# EAGLE schematic 226_arrayrelay (EAGLE 9.6.0)

## Sheet 1 of 9
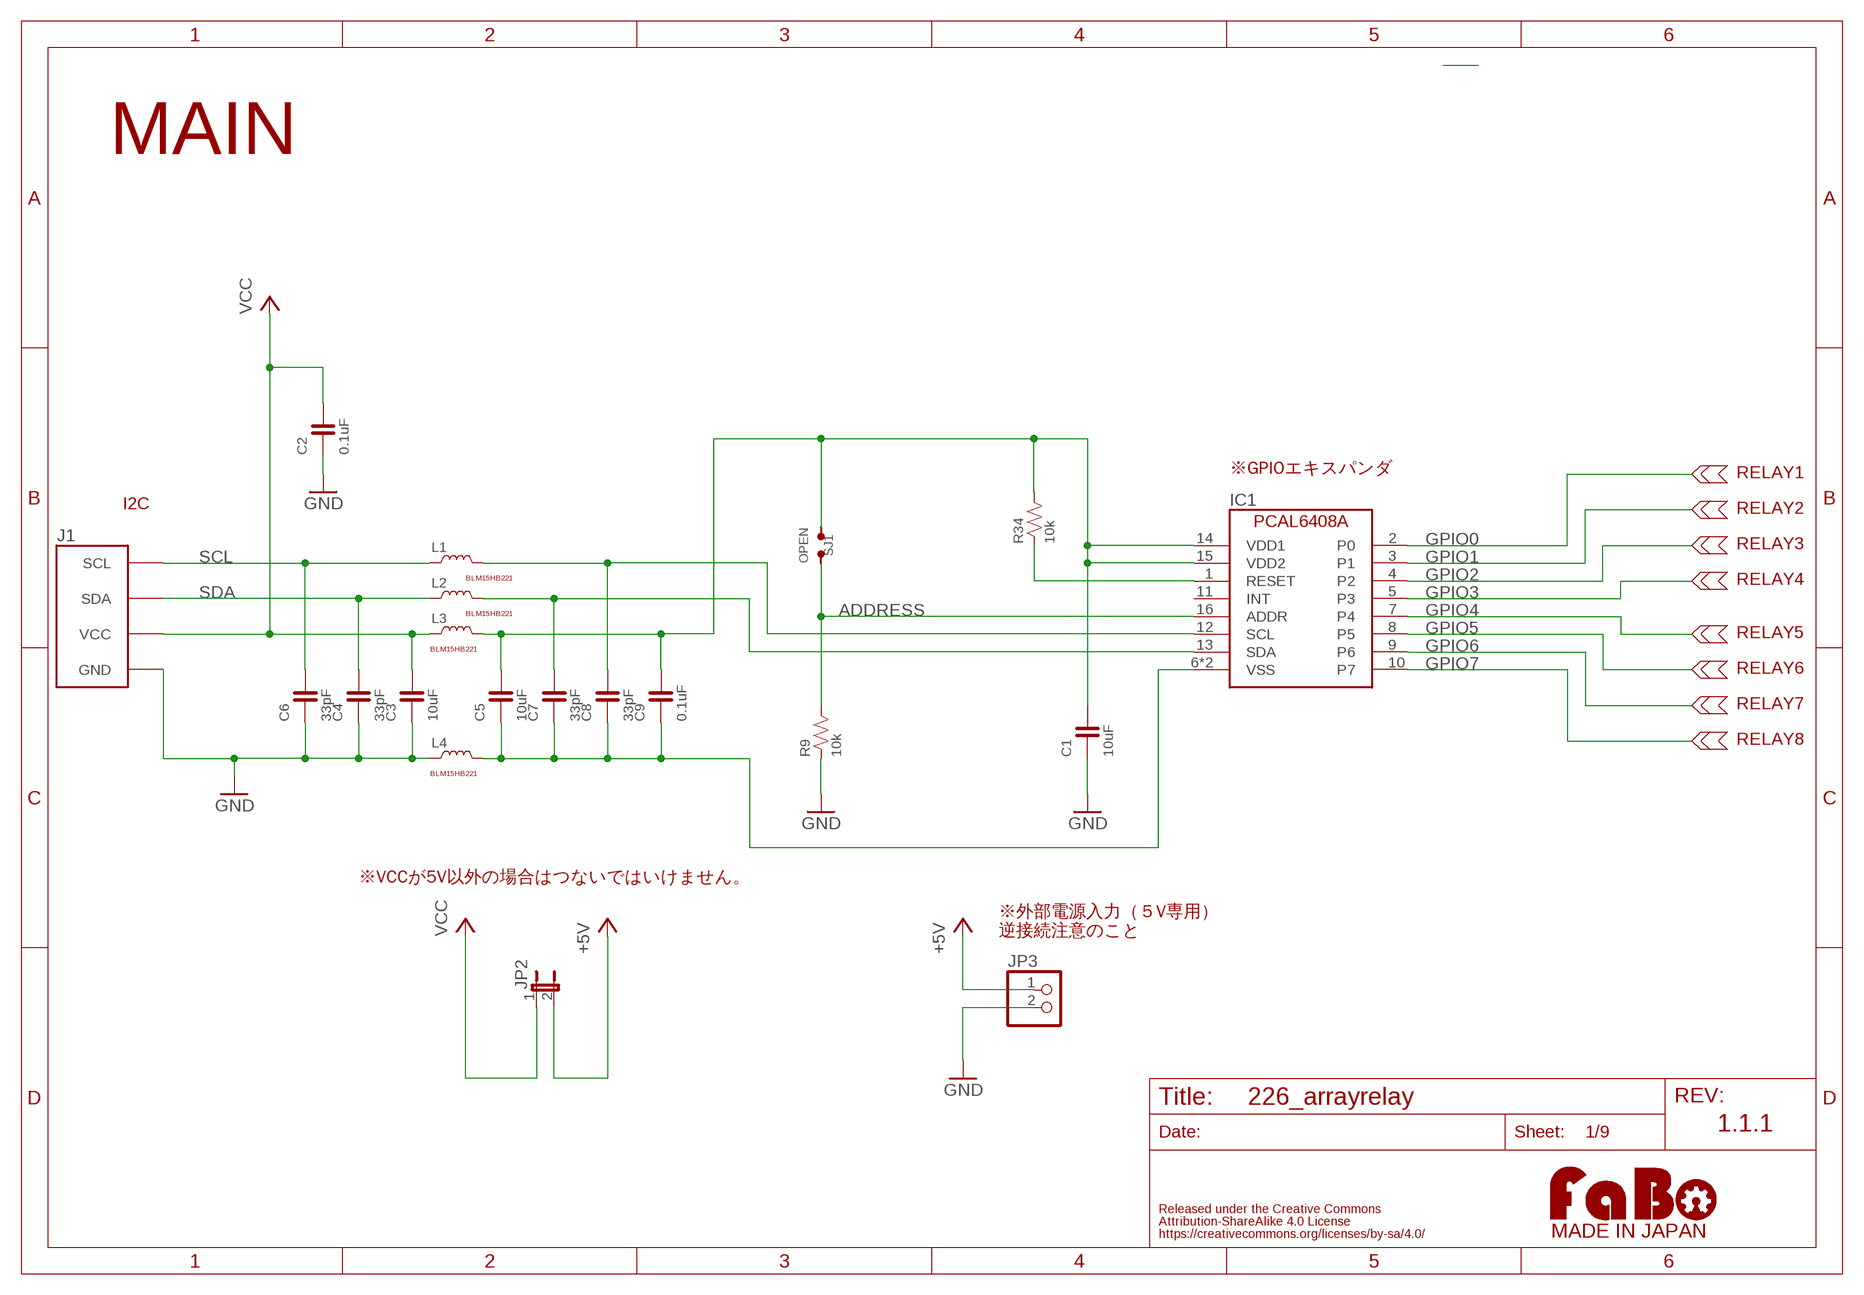
[diagram p0: schematic, sheet 1]

### Parts
C1  10uF  CAPACITOR-0603  [0603]
C2  0.1uF  CAPACITOR-0603  [0603]
C3  10uF  CAPACITOR-0603  [0603]
C4  33pF  CAPACITOR-0603  [0603]
C5  10uF  CAPACITOR-0603  [0603]
C6  33pF  CAPACITOR-0603  [0603]
C7  33pF  CAPACITOR-0603  [0603]
C8  33pF  CAPACITOR-0603  [0603]
C9  0.1uF  CAPACITOR-0603  [0603]
IC1  NX-PCAL6408A  [NXP-PCAL6408A]
J1  FABO_BRICK_I2C-S04B-PASK-2_LONG  [FABO_BRICK_I2C_S04B-PASK-2_LONG]
JP2  JP1E  [JP1]
JP3  PINHD-1X2  [1X02]
L1  COIL-0402  [0402]
L2  COIL-0402  [0402]
L3  COIL-0402  [0402]
L4  COIL-0402  [0402]
R9  10k  RESISTOR-0603-NARROW  [0603-NARROW]
R34  10k  RESISTOR-0603-NARROW  [0603-NARROW]
SJ1  OPEN  SMD-JUMPER-2-OPEN  [SMD-JUMPER-2-OPEN]
U$4  LOGO_FABO-M  [LOGO_FABO_MS]

### Nets
+5V: JP2.2 JP3.1 ; also sheet 2,3,4,5,6,7,8,9
ADDRESS: IC1.16(ADDR) R9.2 SJ1.2
GND: C1.1 C2.1 C3.1 C4.1 C6.1 J1.GND JP3.2 L4.P$1 R9.1 ; also sheet 2,3,4,5,6,7,8,9
GPIO0: IC1.2(P0) ; also sheet 2
GPIO1: IC1.3(P1) ; also sheet 3
GPIO2: IC1.4(P2) ; also sheet 4
GPIO3: IC1.5(P3) ; also sheet 5
GPIO4: IC1.7(P4) ; also sheet 6
GPIO5: IC1.8(P5) ; also sheet 7
GPIO6: IC1.9(P6) ; also sheet 8
GPIO7: IC1.10(P7) ; also sheet 9
N$66: IC1.1(RESET) R34.1
N$70: C8.2 IC1.12(SCL) L1.P$2
N$71: C7.2 IC1.13(SDA) L2.P$2
N$72: C1.2 C5.2 C9.2 IC1.14(VDD1) IC1.15(VDD2) L3.P$2 R34.2 SJ1.1
N$73: C5.1 C7.1 C8.1 C9.1 IC1.6(VSS) IC1.17(VSS) L4.P$2
SCL: C6.2 J1.SCL L1.P$1
SDA: C4.2 J1.SDA L2.P$1
VCC: C2.2 C3.2 J1.VCC JP2.1 L3.P$1 ; also sheet 2,3,4,5,6,7,8,9
Unconnected: IC1.11(INT)

### Notes on the sheet
- MAIN
- ※GPIOエキスパンダ | RELAY1
- ※I2C | RELAY2
- RELAY3
- BLM15HB221
- RELAY4
- BLM15HB221
- RELAY5
- BLM15HB221
- RELAY6
- RELAY7
- RELAY8
- BLM15HB221
- ※VCCが5V以外の場合はつないではいけません。
- ※外部電源入力（５V専用）
  逆接続注意のこと
- 1.1.1

## Sheet 2 of 9
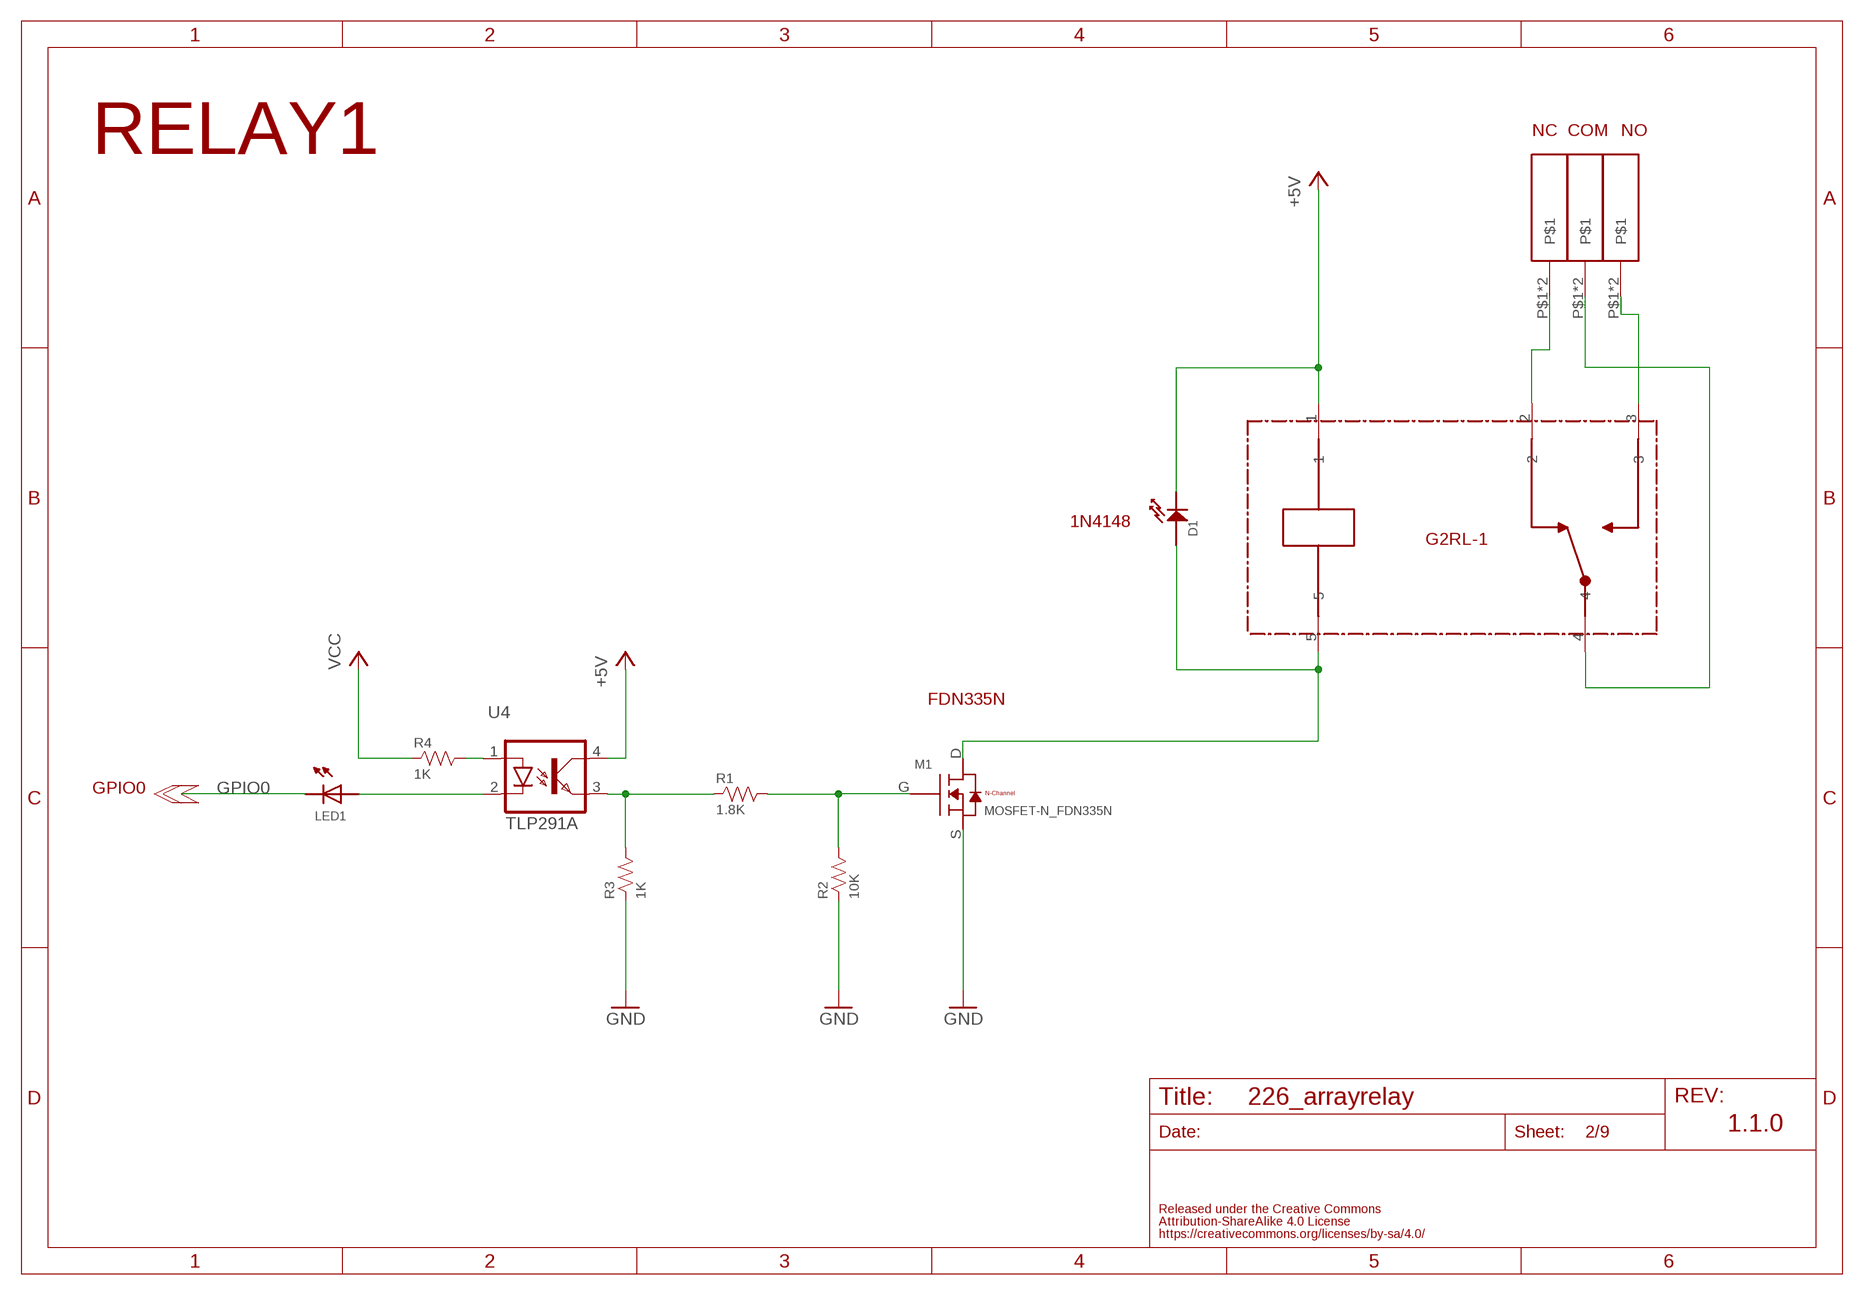
[diagram p1: schematic, sheet 2]

### Parts
COM1  TBL004-508  [TBL004-508]
D1  1N4188  DIODE0603  [0603]
LED1  LED-0402-NO_SILK  [0402-NO_SILK]
M1  MOSFET-N_FDN335N  [SUPERSOT-3]
NC1  TBL004-508  [TBL004-508]
R1  1.8K  RESISTOR-0603-NARROW  [0603-NARROW]
R2  10K  RESISTOR-0603-NARROW  [0603-NARROW]
R3  1K  RESISTOR-0603-NARROW  [0603-NARROW]
R4  1K  RESISTOR-0603-NARROW  [0603-NARROW]
RL1  G2RL-1  [G2RL-1]
U4  TLP291A  [11-3C1]
U$7  TBL004-508  [TBL004-508]

### Nets
+5V: D1.CATHODE RL1.1 U4.4(COL) ; also sheet 1,3,4,5,6,7,8,9
GND: M1.S R2.1 R3.1 ; also sheet 1,3,4,5,6,7,8,9
GPIO0: LED1.CATHODE ; also sheet 1
N$2: D1.ANODE M1.D RL1.5
N$3: R1.1 R3.2 U4.3(EMI)
N$4: M1.G R1.2 R2.2
N$5: LED1.ANODE U4.2(C)
N$7: R4.2 U4.1(A)
N$8: NC1.P$1 NC1.P$2 RL1.2
N$9: COM1.P$1 COM1.P$2 RL1.4
N$10: RL1.3 U$7.P$1 U$7.P$2
VCC: R4.1 ; also sheet 1,3,4,5,6,7,8,9

### Notes on the sheet
- NC | COM | NO
- RELAY1
- 1N4148
- G2RL-1
- FDN335N
- GPIO0
- 1.1.0

## Sheet 3 of 9
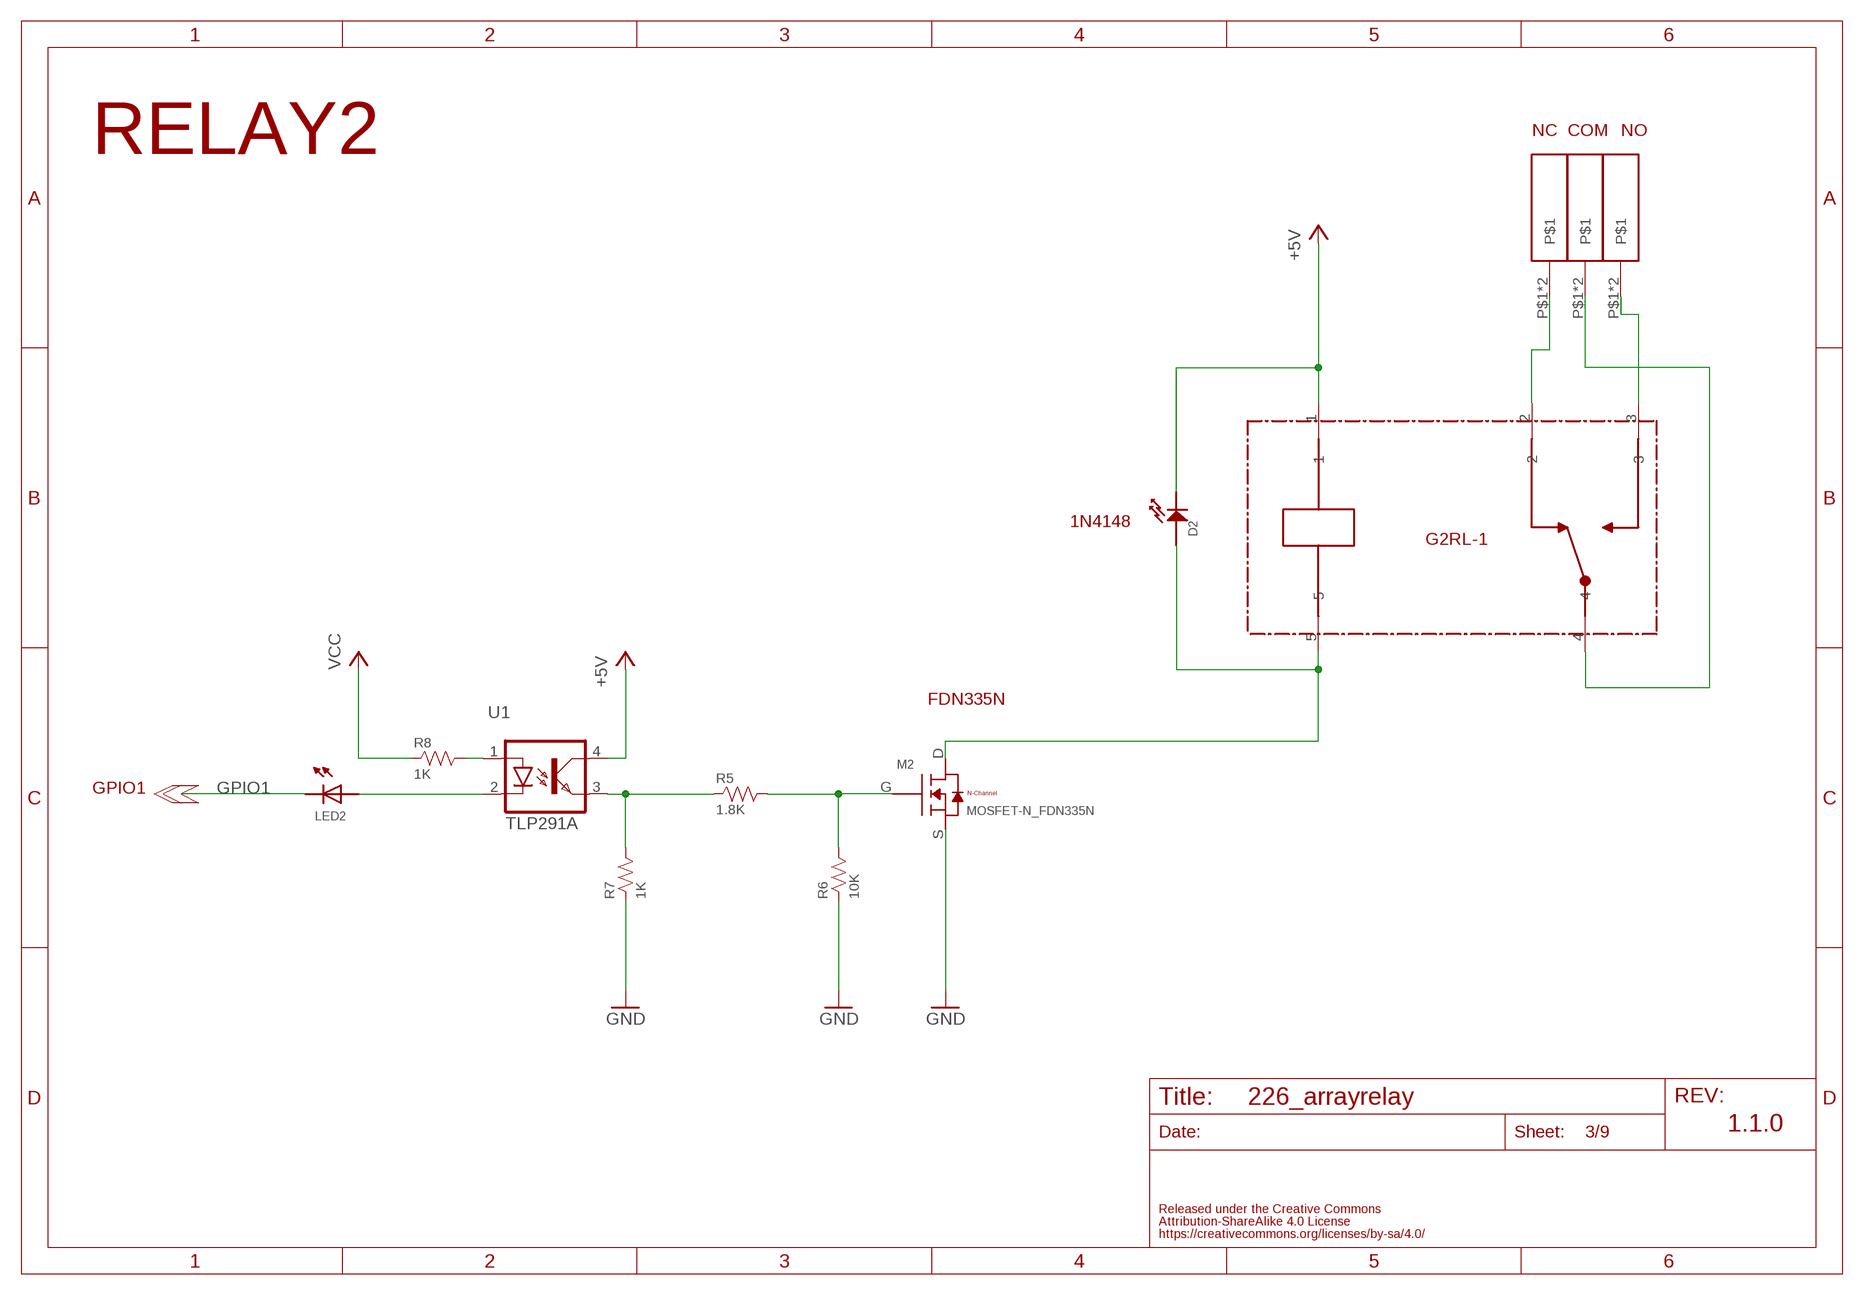
[diagram p2: schematic, sheet 3]

### Parts
COM2  TBL004-508  [TBL004-508]
D2  1N4188  DIODE0603  [0603]
LED2  LED-0402-NO_SILK  [0402-NO_SILK]
M2  MOSFET-N_FDN335N  [SUPERSOT-3]
NC2  TBL004-508  [TBL004-508]
R5  1.8K  RESISTOR-0603-NARROW  [0603-NARROW]
R6  10K  RESISTOR-0603-NARROW  [0603-NARROW]
R7  1K  RESISTOR-0603-NARROW  [0603-NARROW]
R8  1K  RESISTOR-0603-NARROW  [0603-NARROW]
RL2  G2RL-1  [G2RL-1]
U1  TLP291A  [11-3C1]
U$9  TBL004-508  [TBL004-508]

### Nets
+5V: D2.CATHODE RL2.1 U1.4(COL) ; also sheet 1,2,4,5,6,7,8,9
GND: M2.S R6.1 R7.1 ; also sheet 1,2,4,5,6,7,8,9
GPIO1: LED2.CATHODE ; also sheet 1
N$6: D2.ANODE M2.D RL2.5
N$11: R5.1 R7.2 U1.3(EMI)
N$12: M2.G R5.2 R6.2
N$13: NC2.P$1 NC2.P$2 RL2.2
N$14: COM2.P$1 COM2.P$2 RL2.4
N$15: RL2.3 U$9.P$1 U$9.P$2
N$16: LED2.ANODE U1.2(C)
N$17: R8.2 U1.1(A)
VCC: R8.1 ; also sheet 1,2,4,5,6,7,8,9

### Notes on the sheet
- NC | COM | NO
- RELAY2
- 1N4148
- G2RL-1
- FDN335N
- GPIO1
- 1.1.0

## Sheet 4 of 9
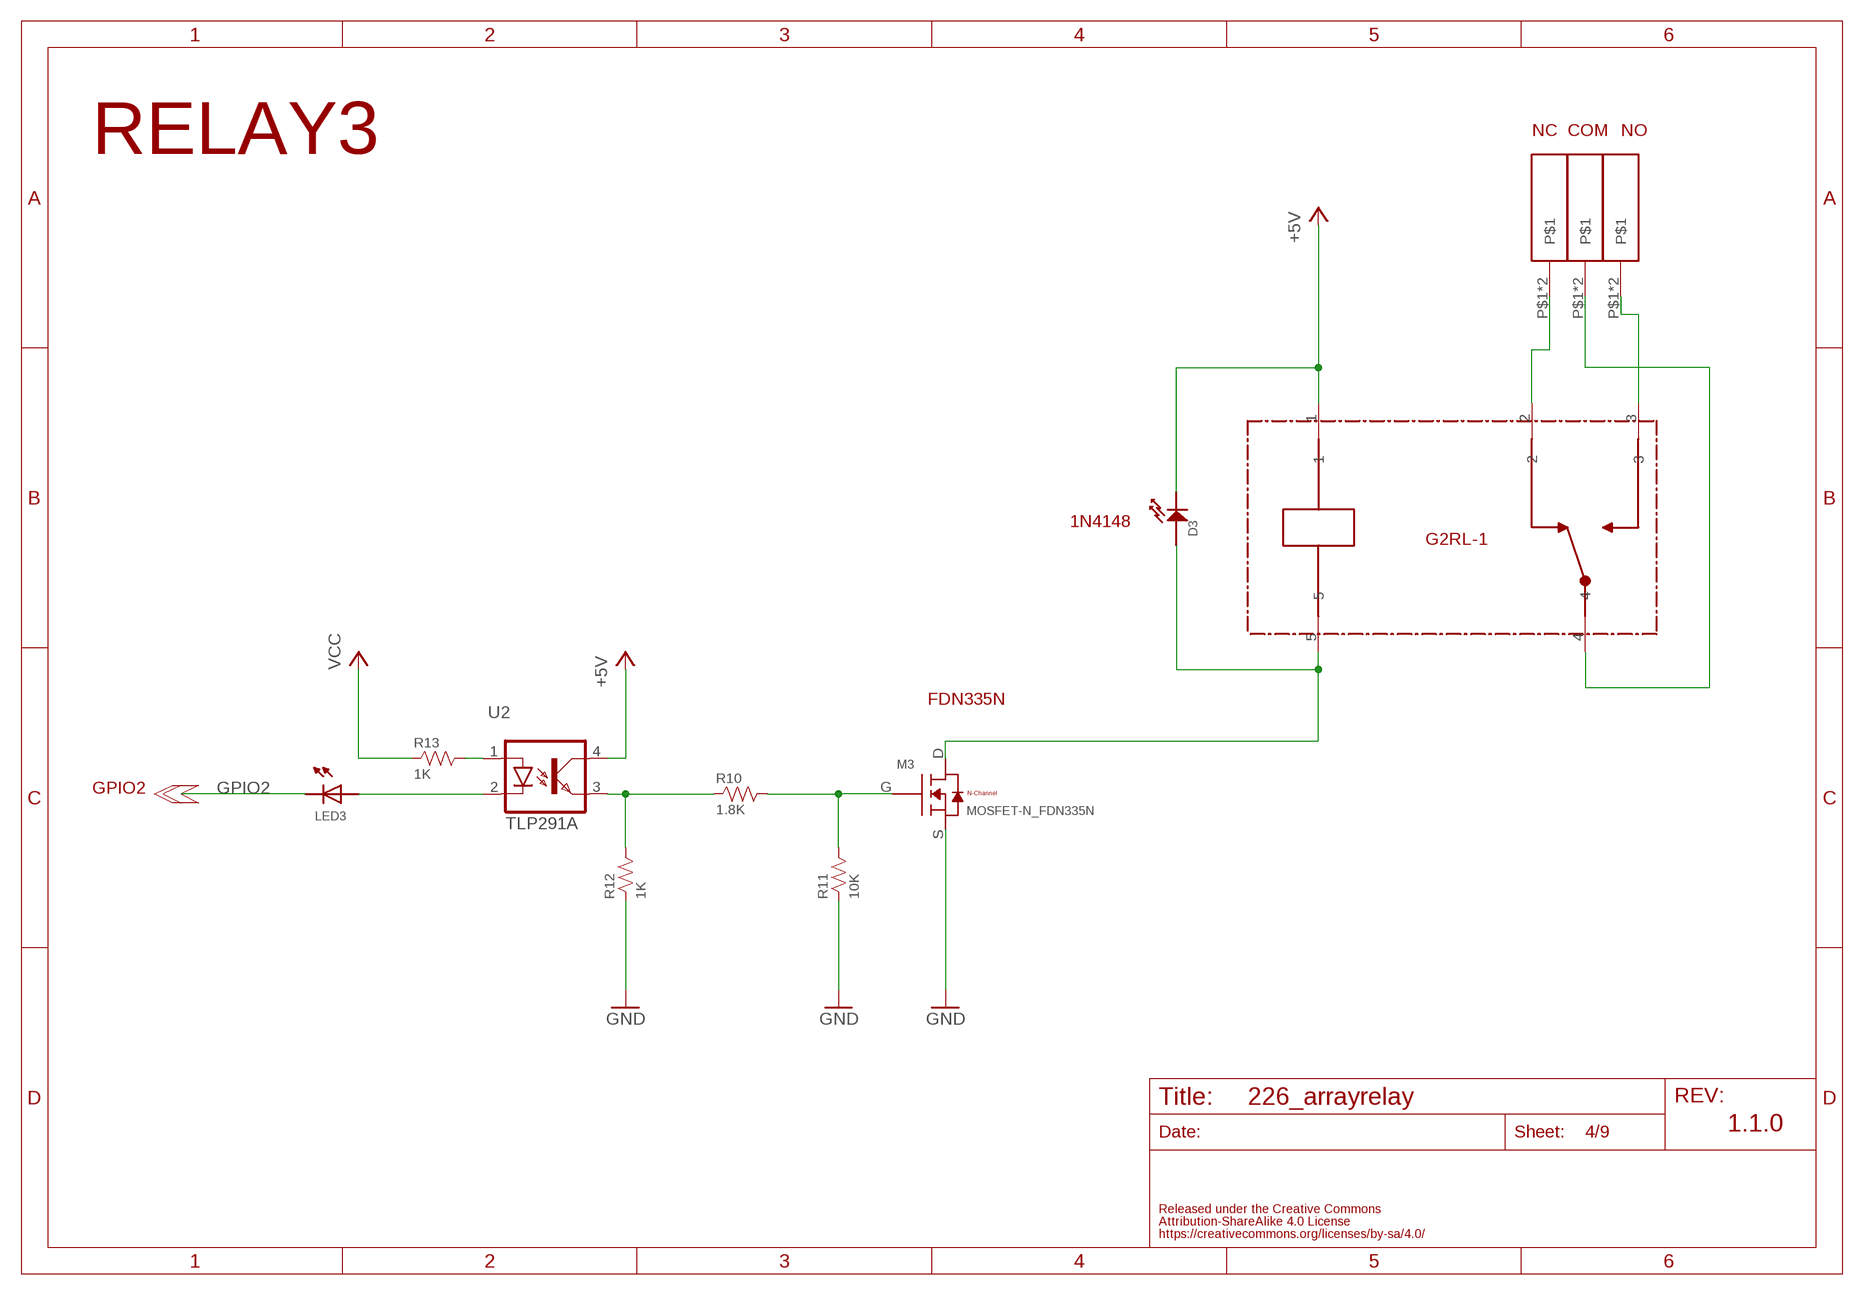
[diagram p3: schematic, sheet 4]

### Parts
COM3  TBL004-508  [TBL004-508]
D3  1N4188  DIODE0603  [0603]
LED3  LED-0402-NO_SILK  [0402-NO_SILK]
M3  MOSFET-N_FDN335N  [SUPERSOT-3]
NC3  TBL004-508  [TBL004-508]
R10  1.8K  RESISTOR-0603-NARROW  [0603-NARROW]
R11  10K  RESISTOR-0603-NARROW  [0603-NARROW]
R12  1K  RESISTOR-0603-NARROW  [0603-NARROW]
R13  1K  RESISTOR-0603-NARROW  [0603-NARROW]
RL3  G2RL-1  [G2RL-1]
U2  TLP291A  [11-3C1]
U$12  TBL004-508  [TBL004-508]

### Nets
+5V: D3.CATHODE RL3.1 U2.4(COL) ; also sheet 1,2,3,5,6,7,8,9
GND: M3.S R11.1 R12.1 ; also sheet 1,2,3,5,6,7,8,9
GPIO2: LED3.CATHODE ; also sheet 1
N$18: D3.ANODE M3.D RL3.5
N$19: R10.1 R12.2 U2.3(EMI)
N$20: M3.G R10.2 R11.2
N$21: NC3.P$1 NC3.P$2 RL3.2
N$22: COM3.P$1 COM3.P$2 RL3.4
N$23: RL3.3 U$12.P$1 U$12.P$2
N$24: LED3.ANODE U2.2(C)
N$25: R13.2 U2.1(A)
VCC: R13.1 ; also sheet 1,2,3,5,6,7,8,9

### Notes on the sheet
- NC | COM | NO
- RELAY3
- 1N4148
- G2RL-1
- FDN335N
- GPIO2
- 1.1.0

## Sheet 5 of 9
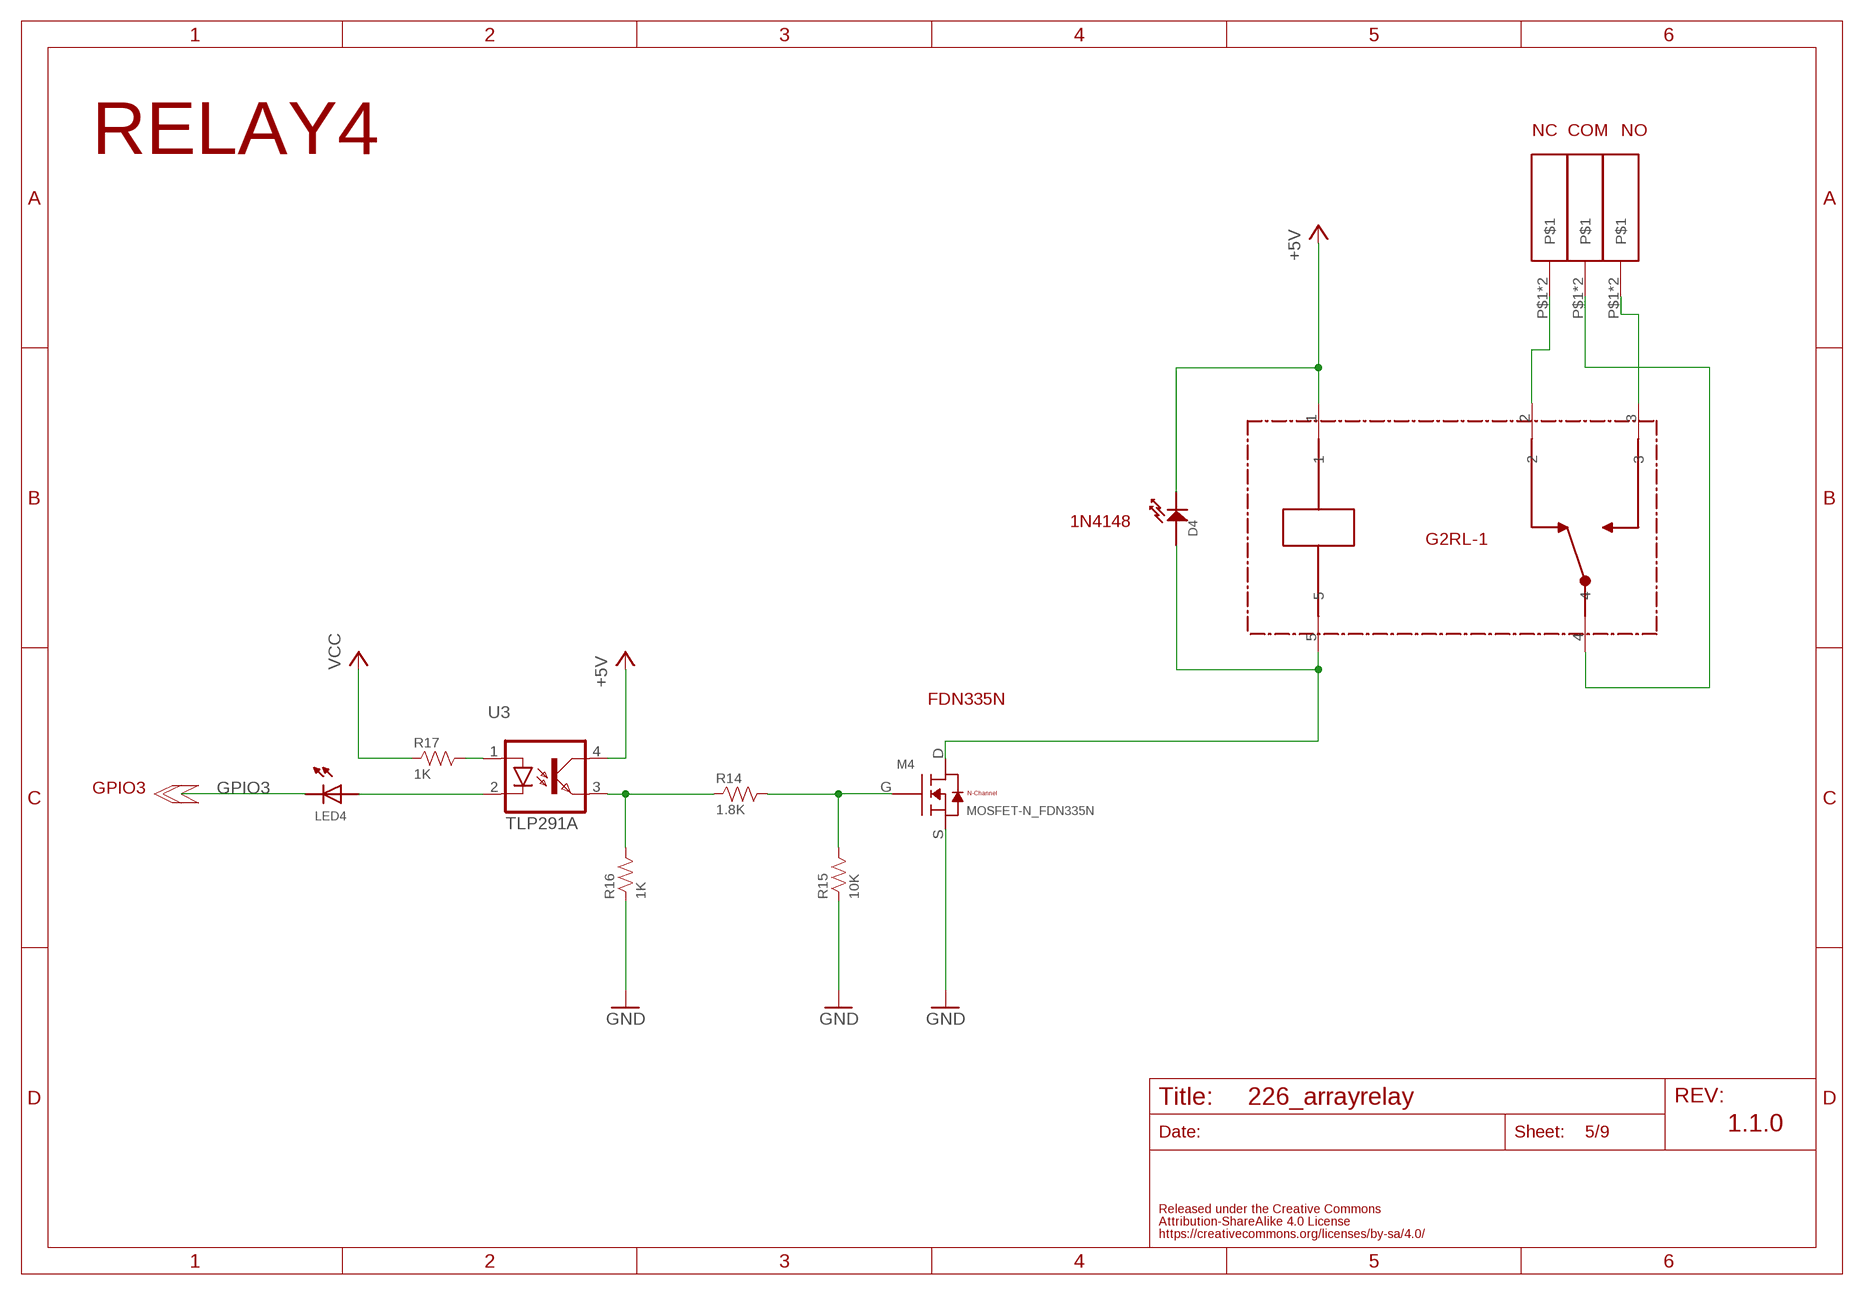
[diagram p4: schematic, sheet 5]

### Parts
COM4  TBL004-508  [TBL004-508]
D4  1N4188  DIODE0603  [0603]
LED4  LED-0402-NO_SILK  [0402-NO_SILK]
M4  MOSFET-N_FDN335N  [SUPERSOT-3]
NC4  TBL004-508  [TBL004-508]
R14  1.8K  RESISTOR-0603-NARROW  [0603-NARROW]
R15  10K  RESISTOR-0603-NARROW  [0603-NARROW]
R16  1K  RESISTOR-0603-NARROW  [0603-NARROW]
R17  1K  RESISTOR-0603-NARROW  [0603-NARROW]
RL4  G2RL-1  [G2RL-1]
U3  TLP291A  [11-3C1]
U$15  TBL004-508  [TBL004-508]

### Nets
+5V: D4.CATHODE RL4.1 U3.4(COL) ; also sheet 1,2,3,4,6,7,8,9
GND: M4.S R15.1 R16.1 ; also sheet 1,2,3,4,6,7,8,9
GPIO3: LED4.CATHODE ; also sheet 1
N$26: D4.ANODE M4.D RL4.5
N$27: R14.1 R16.2 U3.3(EMI)
N$28: M4.G R14.2 R15.2
N$29: NC4.P$1 NC4.P$2 RL4.2
N$30: COM4.P$1 COM4.P$2 RL4.4
N$31: RL4.3 U$15.P$1 U$15.P$2
N$32: LED4.ANODE U3.2(C)
N$33: R17.2 U3.1(A)
VCC: R17.1 ; also sheet 1,2,3,4,6,7,8,9

### Notes on the sheet
- NC | COM | NO
- RELAY4
- 1N4148
- G2RL-1
- FDN335N
- GPIO3
- 1.1.0

## Sheet 6 of 9
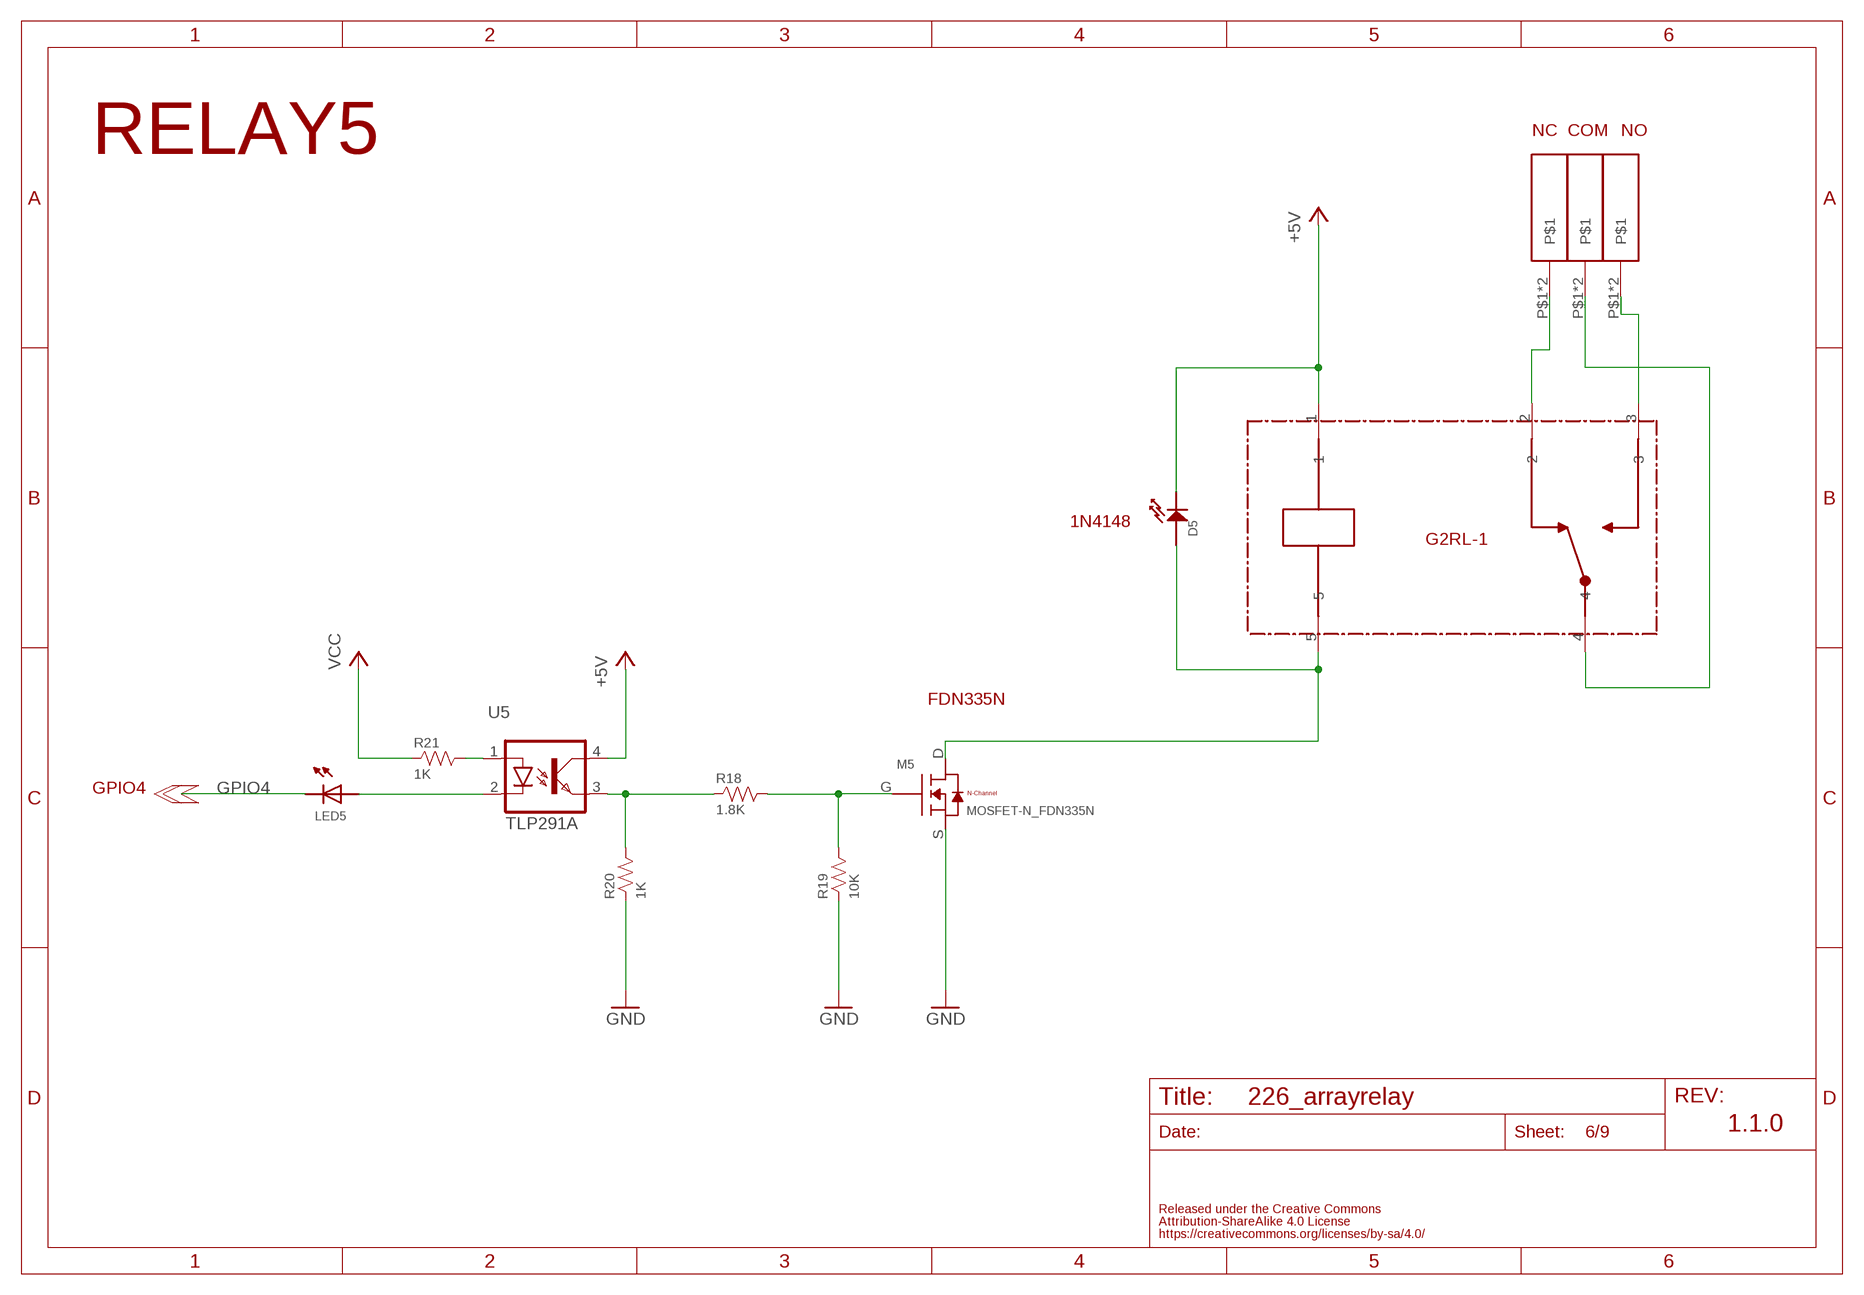
[diagram p5: schematic, sheet 6]

### Parts
COM5  TBL004-508  [TBL004-508]
D5  1N4188  DIODE0603  [0603]
LED5  LED-0402-NO_SILK  [0402-NO_SILK]
M5  MOSFET-N_FDN335N  [SUPERSOT-3]
NC5  TBL004-508  [TBL004-508]
R18  1.8K  RESISTOR-0603-NARROW  [0603-NARROW]
R19  10K  RESISTOR-0603-NARROW  [0603-NARROW]
R20  1K  RESISTOR-0603-NARROW  [0603-NARROW]
R21  1K  RESISTOR-0603-NARROW  [0603-NARROW]
RL5  G2RL-1  [G2RL-1]
U5  TLP291A  [11-3C1]
U$18  TBL004-508  [TBL004-508]

### Nets
+5V: D5.CATHODE RL5.1 U5.4(COL) ; also sheet 1,2,3,4,5,7,8,9
GND: M5.S R19.1 R20.1 ; also sheet 1,2,3,4,5,7,8,9
GPIO4: LED5.CATHODE ; also sheet 1
N$34: D5.ANODE M5.D RL5.5
N$35: R18.1 R20.2 U5.3(EMI)
N$36: M5.G R18.2 R19.2
N$37: NC5.P$1 NC5.P$2 RL5.2
N$38: COM5.P$1 COM5.P$2 RL5.4
N$39: RL5.3 U$18.P$1 U$18.P$2
N$40: LED5.ANODE U5.2(C)
N$41: R21.2 U5.1(A)
VCC: R21.1 ; also sheet 1,2,3,4,5,7,8,9

### Notes on the sheet
- NC | COM | NO
- RELAY5
- 1N4148
- G2RL-1
- FDN335N
- GPIO4
- 1.1.0

## Sheet 7 of 9
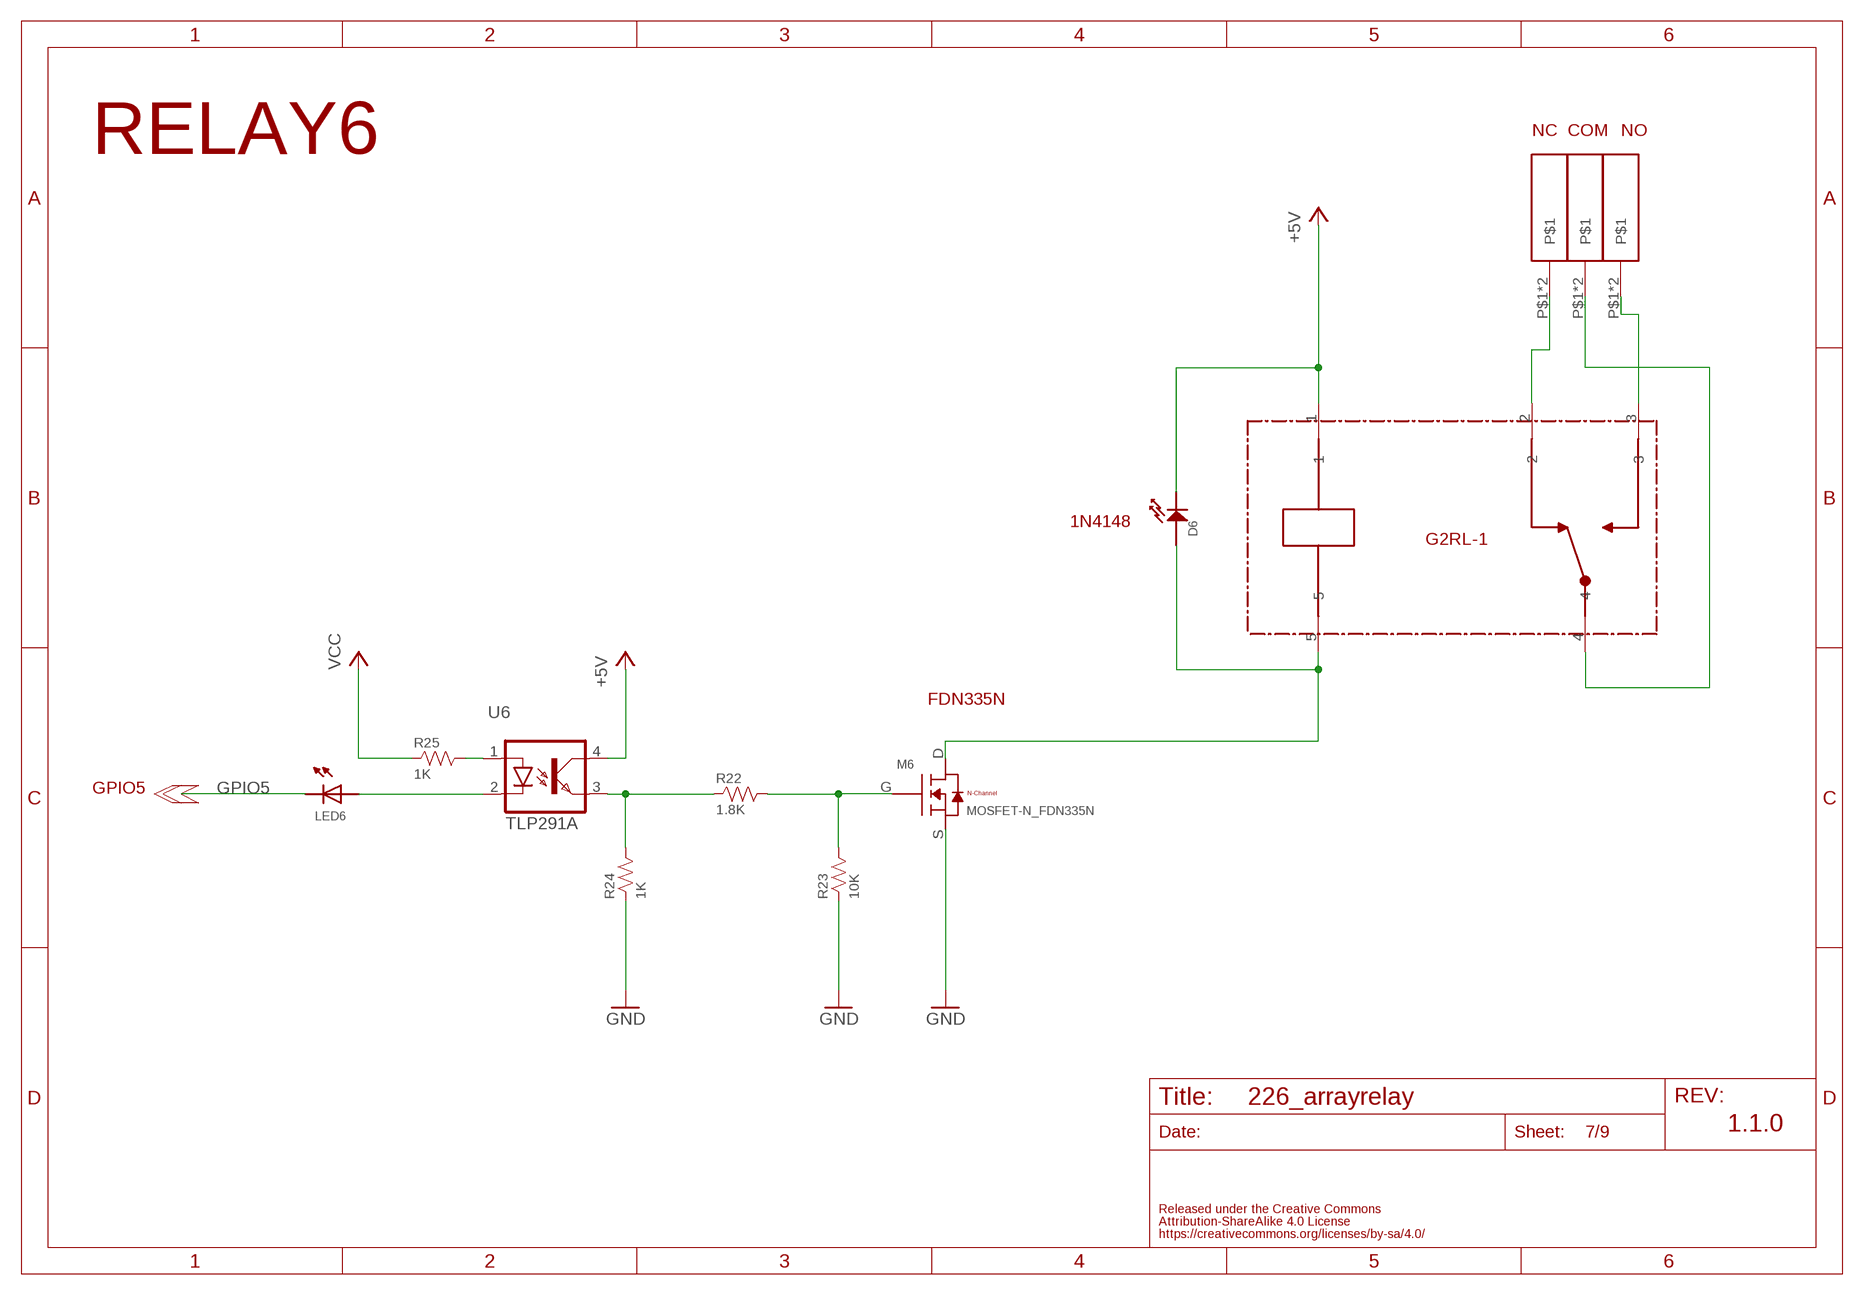
[diagram p6: schematic, sheet 7]

### Parts
COM6  TBL004-508  [TBL004-508]
D6  1N4188  DIODE0603  [0603]
LED6  LED-0402-NO_SILK  [0402-NO_SILK]
M6  MOSFET-N_FDN335N  [SUPERSOT-3]
NC6  TBL004-508  [TBL004-508]
R22  1.8K  RESISTOR-0603-NARROW  [0603-NARROW]
R23  10K  RESISTOR-0603-NARROW  [0603-NARROW]
R24  1K  RESISTOR-0603-NARROW  [0603-NARROW]
R25  1K  RESISTOR-0603-NARROW  [0603-NARROW]
RL6  G2RL-1  [G2RL-1]
U6  TLP291A  [11-3C1]
U$21  TBL004-508  [TBL004-508]

### Nets
+5V: D6.CATHODE RL6.1 U6.4(COL) ; also sheet 1,2,3,4,5,6,8,9
GND: M6.S R23.1 R24.1 ; also sheet 1,2,3,4,5,6,8,9
GPIO5: LED6.CATHODE ; also sheet 1
N$42: D6.ANODE M6.D RL6.5
N$43: R22.1 R24.2 U6.3(EMI)
N$44: M6.G R22.2 R23.2
N$45: NC6.P$1 NC6.P$2 RL6.2
N$46: COM6.P$1 COM6.P$2 RL6.4
N$47: RL6.3 U$21.P$1 U$21.P$2
N$48: LED6.ANODE U6.2(C)
N$49: R25.2 U6.1(A)
VCC: R25.1 ; also sheet 1,2,3,4,5,6,8,9

### Notes on the sheet
- NC | COM | NO
- RELAY6
- 1N4148
- G2RL-1
- FDN335N
- GPIO5
- 1.1.0

## Sheet 8 of 9
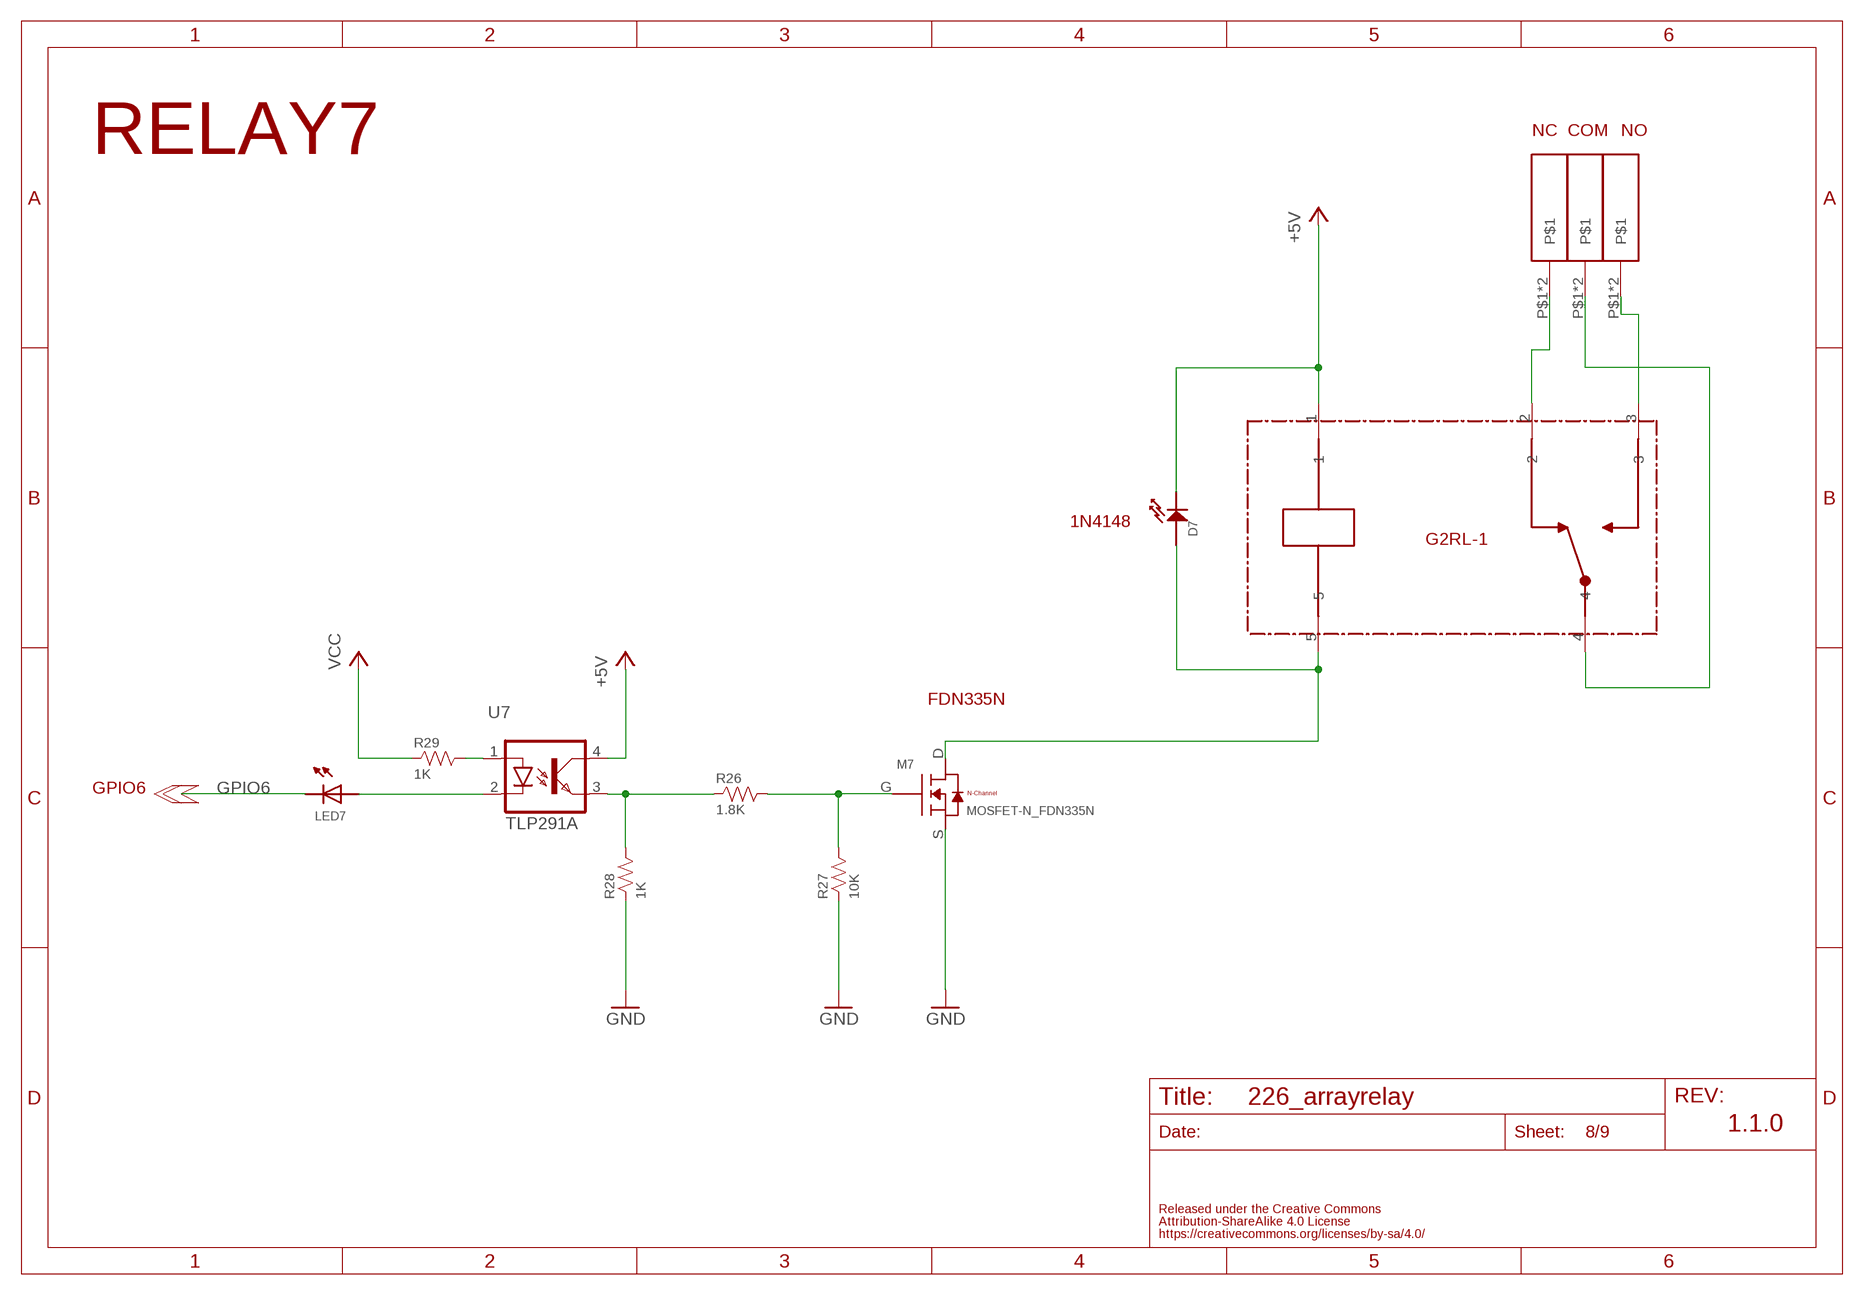
[diagram p7: schematic, sheet 8]

### Parts
COM7  TBL004-508  [TBL004-508]
D7  1N4188  DIODE0603  [0603]
LED7  LED-0402-NO_SILK  [0402-NO_SILK]
M7  MOSFET-N_FDN335N  [SUPERSOT-3]
NC7  TBL004-508  [TBL004-508]
R26  1.8K  RESISTOR-0603-NARROW  [0603-NARROW]
R27  10K  RESISTOR-0603-NARROW  [0603-NARROW]
R28  1K  RESISTOR-0603-NARROW  [0603-NARROW]
R29  1K  RESISTOR-0603-NARROW  [0603-NARROW]
RL7  G2RL-1  [G2RL-1]
U7  TLP291A  [11-3C1]
U$24  TBL004-508  [TBL004-508]

### Nets
+5V: D7.CATHODE RL7.1 U7.4(COL) ; also sheet 1,2,3,4,5,6,7,9
GND: M7.S R27.1 R28.1 ; also sheet 1,2,3,4,5,6,7,9
GPIO6: LED7.CATHODE ; also sheet 1
N$50: D7.ANODE M7.D RL7.5
N$51: R26.1 R28.2 U7.3(EMI)
N$52: M7.G R26.2 R27.2
N$53: NC7.P$1 NC7.P$2 RL7.2
N$54: COM7.P$1 COM7.P$2 RL7.4
N$55: RL7.3 U$24.P$1 U$24.P$2
N$56: LED7.ANODE U7.2(C)
N$57: R29.2 U7.1(A)
VCC: R29.1 ; also sheet 1,2,3,4,5,6,7,9

### Notes on the sheet
- NC | COM | NO
- RELAY7
- 1N4148
- G2RL-1
- FDN335N
- GPIO6
- 1.1.0

## Sheet 9 of 9
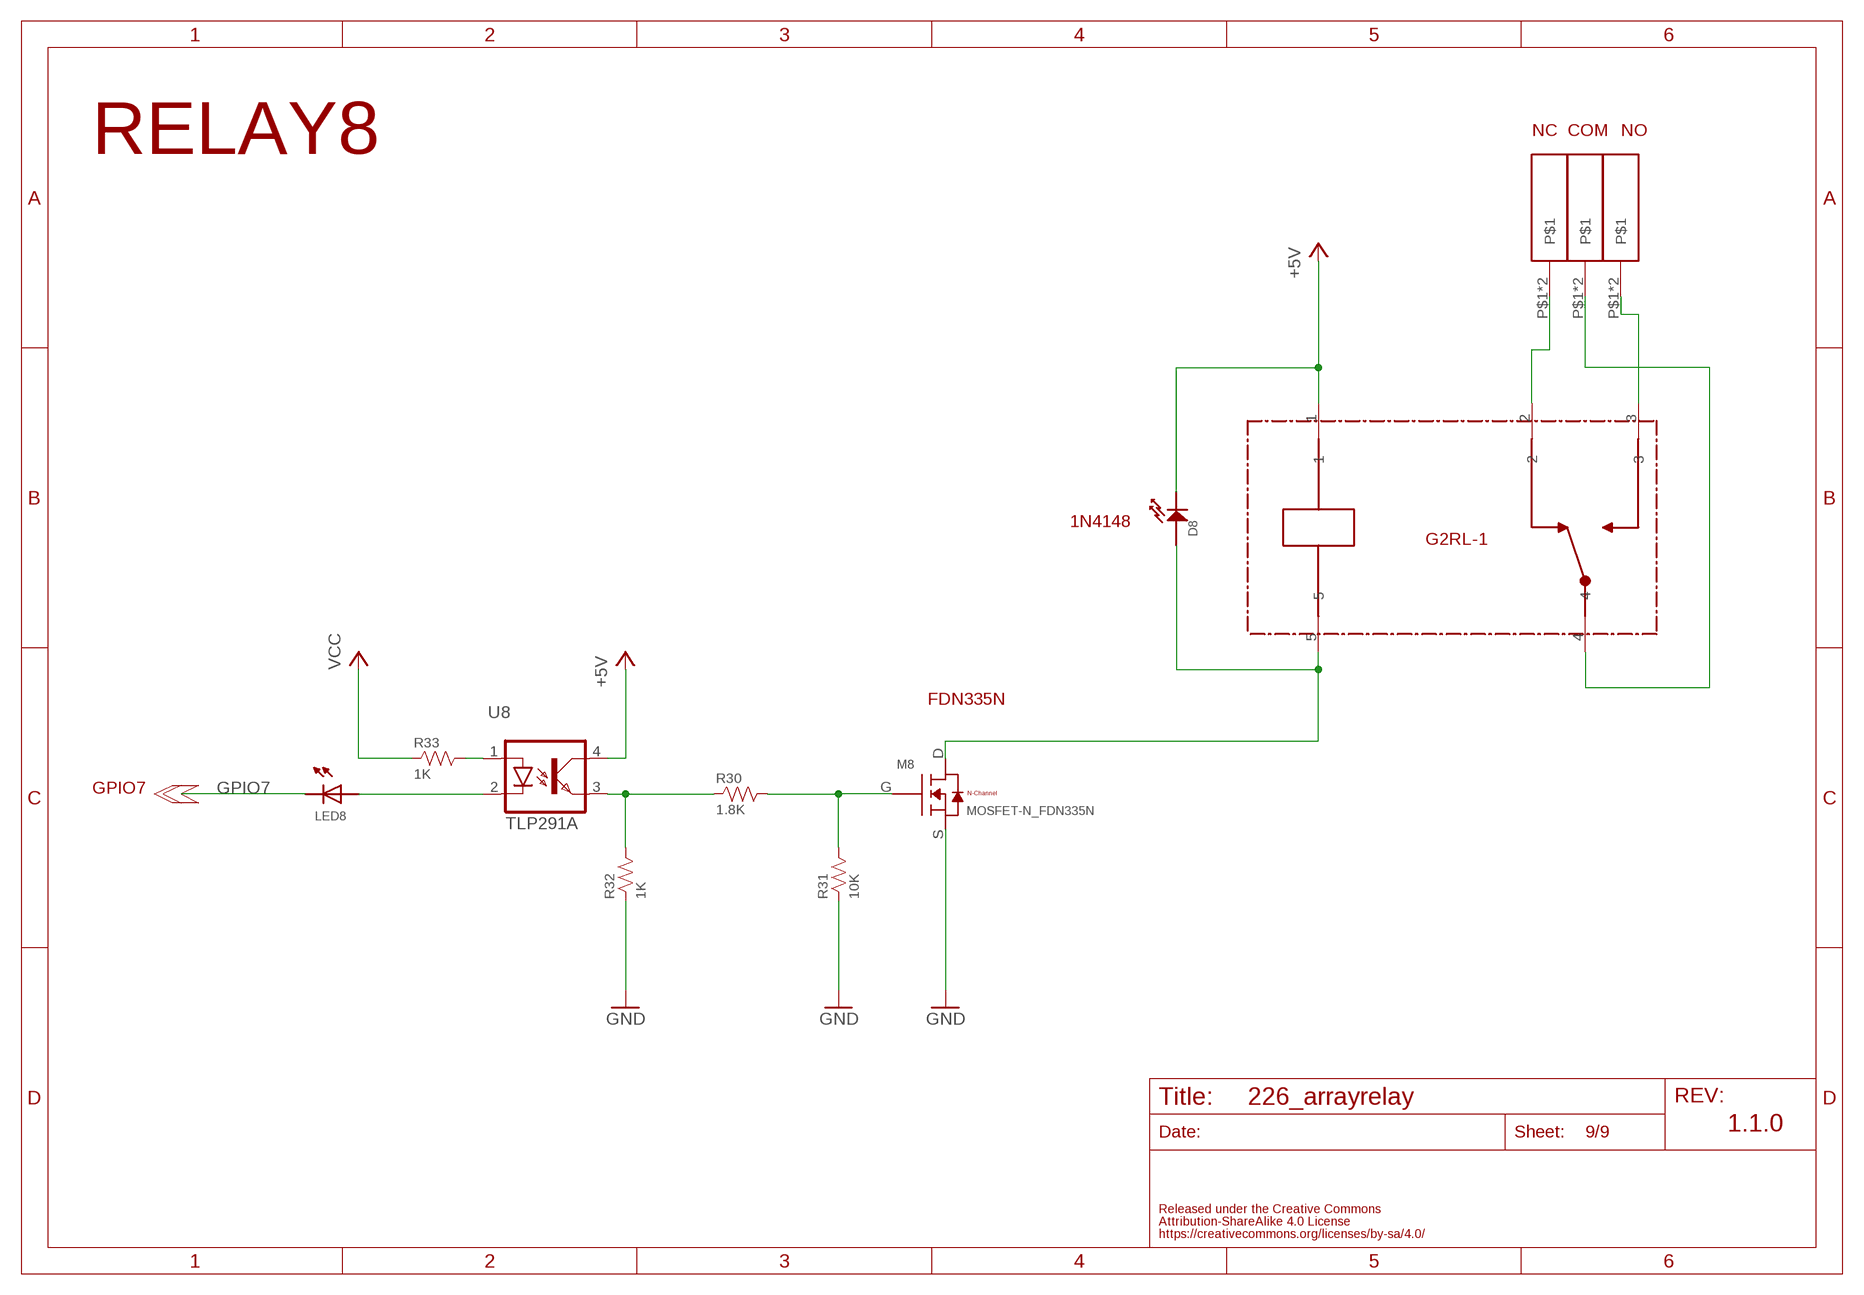
[diagram p8: schematic, sheet 9]

### Parts
COM8  TBL004-508  [TBL004-508]
D8  1N4188  DIODE0603  [0603]
LED8  LED-0402-NO_SILK  [0402-NO_SILK]
M8  MOSFET-N_FDN335N  [SUPERSOT-3]
NC8  TBL004-508  [TBL004-508]
R30  1.8K  RESISTOR-0603-NARROW  [0603-NARROW]
R31  10K  RESISTOR-0603-NARROW  [0603-NARROW]
R32  1K  RESISTOR-0603-NARROW  [0603-NARROW]
R33  1K  RESISTOR-0603-NARROW  [0603-NARROW]
RL8  G2RL-1  [G2RL-1]
U8  TLP291A  [11-3C1]
U$27  TBL004-508  [TBL004-508]

### Nets
+5V: D8.CATHODE RL8.1 U8.4(COL) ; also sheet 1,2,3,4,5,6,7,8
GND: M8.S R31.1 R32.1 ; also sheet 1,2,3,4,5,6,7,8
GPIO7: LED8.CATHODE ; also sheet 1
N$58: D8.ANODE M8.D RL8.5
N$59: R30.1 R32.2 U8.3(EMI)
N$60: M8.G R30.2 R31.2
N$61: NC8.P$1 NC8.P$2 RL8.2
N$62: COM8.P$1 COM8.P$2 RL8.4
N$63: RL8.3 U$27.P$1 U$27.P$2
N$64: LED8.ANODE U8.2(C)
N$65: R33.2 U8.1(A)
VCC: R33.1 ; also sheet 1,2,3,4,5,6,7,8

### Notes on the sheet
- NC | COM | NO
- RELAY8
- 1N4148
- G2RL-1
- FDN335N
- GPIO7
- 1.1.0

## Library data of the parts
C1-C9 = FaBo-Capacitor:CAPACITOR: CAPACITOR
COM1-COM8 NC1-NC8 U$7 U$9 U$12 U$15 U$18 U$21 U$24 U$27 = FaBo-Terminal:TBL004-508
D1-D8 = FaBo-Diode:DIODE
IC1 = FaBo-Mems:NX-PCAL6408A: NXP PCAL6408A
J1 = FaBo-Template:FABO_BRICK_I2C: FaBo Brick I2C
JP2 = jumper:JP1E: JUMPER
JP3 = pinhead:PINHD-1X2: PIN HEADER
L1-L4 = FaBo-Coil:COIL: RESISTOR
LED1-LED8 = FaBo-LED:LED
M1-M8 = FaBo-Mosfet:MOSFET-N
R1-R34 = FaBo-Resistors:RESISTOR: RESISTOR
RL1-RL8 = FaBo-Relay:G2RL-1
SJ1 = FaBo-Supply:SMD-JUMPER-2
U1-U8 = FaBo_Photocoupler:TLP291A
U$4 = FaBo-etc:LOGO_FABO